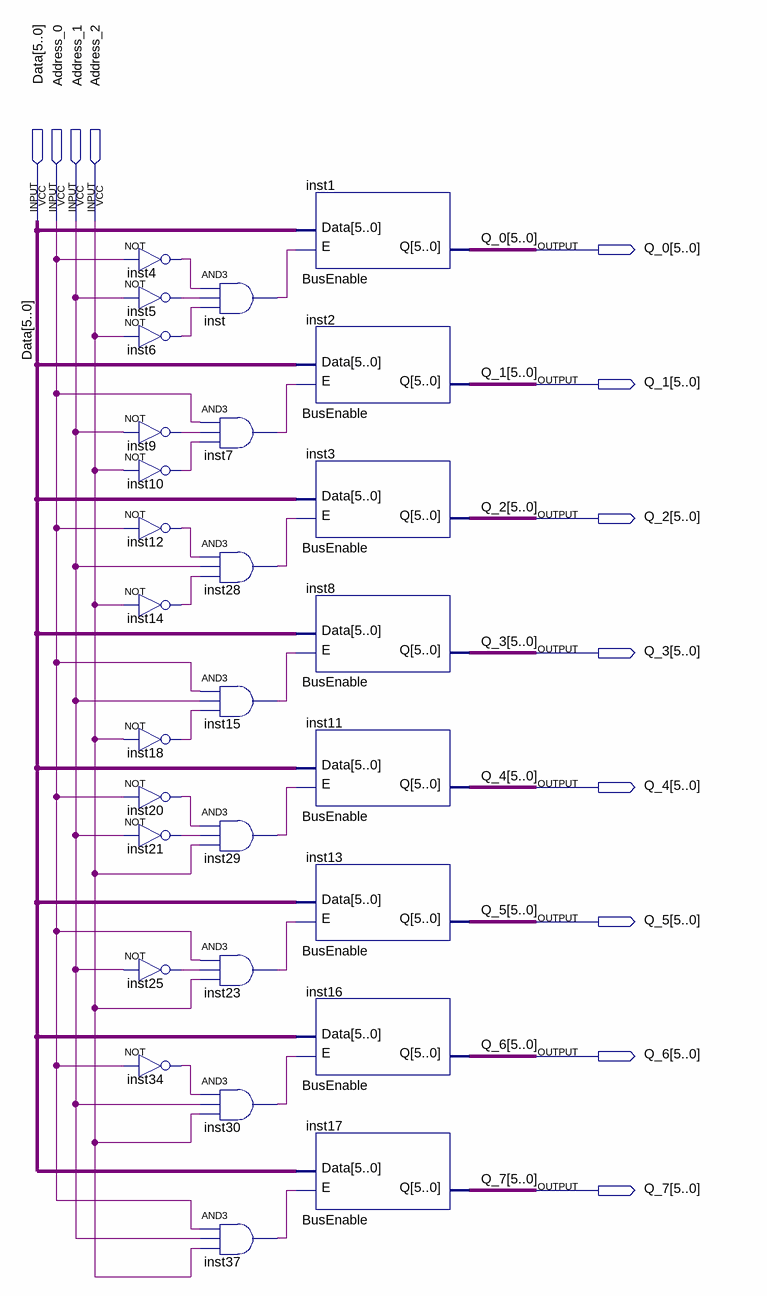
[diagram p0: schematic sheet]
// Quartus schematic DemuxBUS.bdf as structural Verilog: 28 symbols, 12 pins
module DemuxBUS (
  input  [5:0] Data,
  input  Address_0,
  input  Address_1,
  input  Address_2,
  output [5:0] Q_0,
  output [5:0] Q_1,
  output [5:0] Q_2,
  output [5:0] Q_3,
  output [5:0] Q_4,
  output [5:0] Q_5,
  output [5:0] Q_6,
  output [5:0] Q_7
);

  wire inst4_out, inst5_out, inst6_out, inst7_out, inst9_out, inst10_out, inst12_out, inst14_out, inst15_out,
       inst18_out, inst20_out, inst21_out, inst23_out, inst25_out, inst28_out, inst29_out, inst30_out,
       inst34_out, inst37_out, inst_out;

  not inst4 (inst4_out, Address_0);
  not inst5 (inst5_out, Address_1);
  not inst6 (inst6_out, Address_2);
  not inst9 (inst9_out, Address_1);
  not inst10 (inst10_out, Address_2);
  not inst12 (inst12_out, Address_0);
  not inst14 (inst14_out, Address_2);
  not inst18 (inst18_out, Address_2);
  not inst20 (inst20_out, Address_0);
  not inst21 (inst21_out, Address_1);
  not inst25 (inst25_out, Address_1);
  not inst34 (inst34_out, Address_0);
  and inst (inst_out, inst4_out, inst5_out, inst6_out);
  and inst7 (inst7_out, Address_0, inst9_out, inst10_out);
  and inst28 (inst28_out, inst12_out, Address_1, inst14_out);
  and inst15 (inst15_out, Address_0, Address_1, inst18_out);
  and inst29 (inst29_out, inst20_out, inst21_out, Address_2);
  and inst23 (inst23_out, Address_0, inst25_out, Address_2);
  and inst30 (inst30_out, inst34_out, Address_1, Address_2);
  and inst37 (inst37_out, Address_0, Address_1, Address_2);
  BusEnable inst1 (.E(inst_out), .Data(Data), .Q(Q_0));
  BusEnable inst2 (.E(inst7_out), .Data(Data), .Q(Q_1));
  BusEnable inst3 (.E(inst28_out), .Data(Data), .Q(Q_2));
  BusEnable inst8 (.E(inst15_out), .Data(Data), .Q(Q_3));
  BusEnable inst11 (.E(inst29_out), .Data(Data), .Q(Q_4));
  BusEnable inst13 (.E(inst23_out), .Data(Data), .Q(Q_5));
  BusEnable inst16 (.E(inst30_out), .Data(Data), .Q(Q_6));
  BusEnable inst17 (.E(inst37_out), .Data(Data), .Q(Q_7));
endmodule
